# Altium project MAGI'sPower.PrjPcb
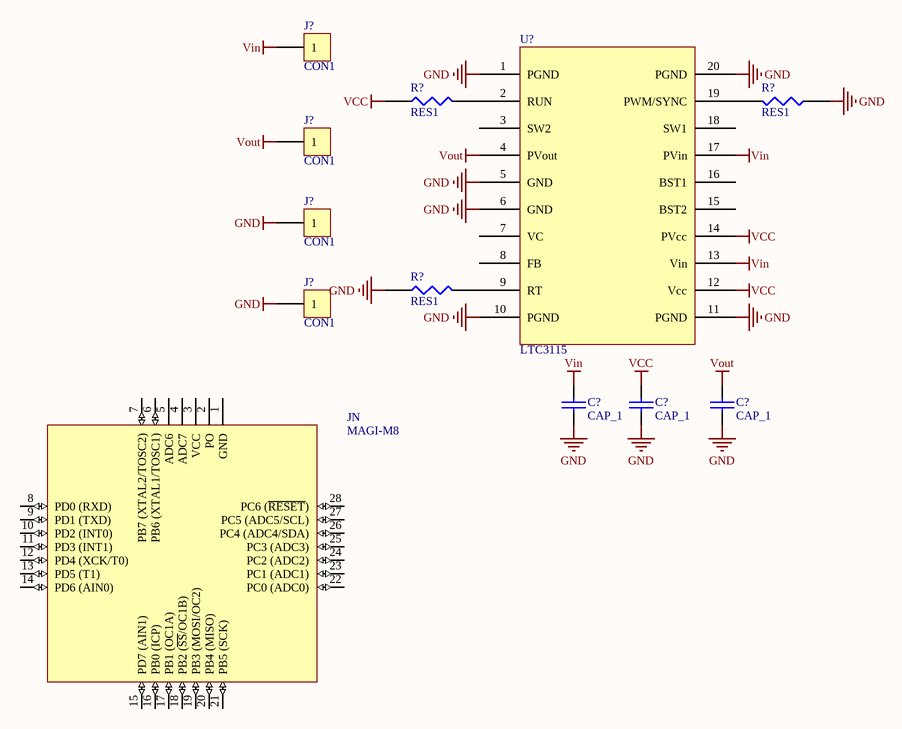
[diagram p0: MAGI'sPower.SchDoc]
1 sheet, 12 parts. Net scope: global (net labels, ports and power ports of the same name join across sheets).
Board file: MAGI'sPower.PcbDoc

## Sheet MAGI'sPower.SchDoc
size A4

### Parts
(Parts that share a designator on the sheet are numbered #1, #2 ... from top to bottom, then left to right.)
C5  CAP_1  [C100]
C6  CAP_1  [C100]
C?  CAP_1  [C100]
J?#1  CON1  [PCBConnect]
J?#2  CON1  [PCBConnect]
J?#3  CON1  [PCBConnect]
J?#4  CON1  [PCBConnect]
JN  MAGI-M8  [MAGI-M8]
R7  RES1  [0805]
R?#1  RES1  [0805]
R?#2  RES1  [0805]
U1  LTC3115  [LTC3115]

### Nets
GND: C5.2 C6.2 C?.2 J?#3.1 J?#4.1 R7.1 R?#2.1 U1.1(PGND) U1.5(GND) U1.6(GND) U1.10(PGND) U1.11(PGND) U1.20(PGND)
VCC: C6.1 R?#1.1 U1.12(Vcc) U1.14(PVcc)
Vin: C5.1 J?#1.1 U1.13(Vin) U1.17(PVin)
Vout: C?.1 J?#2.1 U1.4(PVout)
NetR7_2: R7.2 U1.9(RT)
NetR?#1_2: R?#1.2 U1.2(RUN)
NetR?#2_2: R?#2.2 U1.19(PWM/SYNC)

Not connected (* = marked no-connect by the designer): JN 1(GND) 2(PO) 3(VCC) 4(ADC7) 5(ADC6) 6(PB6_(XTAL1/TOSC1)) 7(PB7_(XTAL2/TOSC2)) 8(PD0_(RXD)) 9(PD1_(TXD)) 10(PD2_(INT0)) 11(PD3_(INT1)) 12(PD4_(XCK/T0)) 13(PD5_(T1)) 14(PD6_(AIN0)) 15(PD7_(AIN1)) 16(PB0_(ICP)) 17(PB1_(OC1A)) 18(PB2_(~{SS}/OC1B)) 19(PB3_(MOSI/OC2)) 20(PB4_(MISO)) 21(PB5_(SCK)) 22(PC0_(ADC0)) 23(PC1_(ADC1)) 24(PC2_(ADC2)) 25(PC3_(ADC3)) 26(PC4_(ADC4/SDA)) 27(PC5_(ADC5/SCL)) 28(PC6_(~{RESET})); U1 3(SW2) 7(VC) 8(FB) 15(BST2) 16(BST1) 18(SW1)

### Library data of the parts
C5 C6 C? = CAP_1: Capacitor
J?#1-J?#4 = CON1: Connector